# Altium schematic sheet CAN_5V.SchDoc
size A
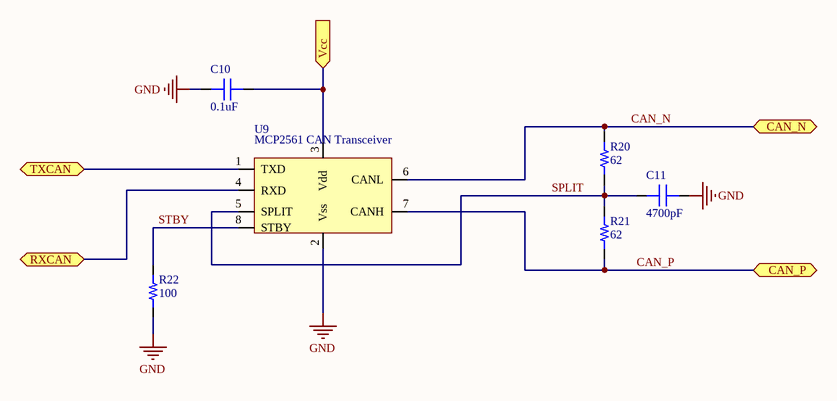
[diagram p0: CAN_5V.SchDoc]

## Parts
C10  capacitance: 0.1uF  [0603]  (hidden comment: capacitor)
C11  capacitance: 4700pF  [0603]  (hidden comment: capacitor)
R20  62  [RES 0603/1608]
R21  resistance: 62  [RES 0603/1608]  (hidden comment: resistor)
R22  resistance: 100  [RES 0603/1608]  (hidden comment: resistor)
U9  MCP2561 CAN Transceiver  [SOIC-8]

## Ports
CAN_N (bidir), CAN_P (bidir), RXCAN (bidir), TXCAN (bidir), Vcc (in)

## Nets
GND: C10.1 C11.2 R22.2 U9.2(Vss)
CAN_N: R20.2 U9.6(CANL) ; port CAN_N
CAN_P: R21.2 U9.7(CANH) ; port CAN_P
RXCAN: U9.4(RXD) ; port RXCAN
SPLIT: C11.1 R20.1 R21.1 U9.5(SPLIT)
STBY: R22.1 U9.8(STBY)
TXCAN: U9.1(TXD) ; port TXCAN
Vcc: C10.2 U9.3(Vdd) ; port Vcc

## Library data of the parts
C10 C11 = 1: Generic 0603 capacitor; id: 1; voltage: 50; dielectric: Ceramic; percent tolerance: 10; name: 0603 Capacitor; ESR: 1; package: 0603; quantity: 0
R20-R22 = 1: id: 1; name: 0603 Resistor; percent tolerance: 5; package: 0603; quantity: 0
  R20: resistance: 62
U9 = 5: id: 5; name: null; vcc: 0; type: CAN; package: SOIC-8; quantity: 0; link: https://www.digikey.com/product-detail/en/microchip-technology/MCP2561T-E-SN/MCP2561T-E-SNCT-ND/5148846